# EAGLE design airball_sensor_board_v8 (EAGLE 9.6.2)

## Sheet 1 of 5
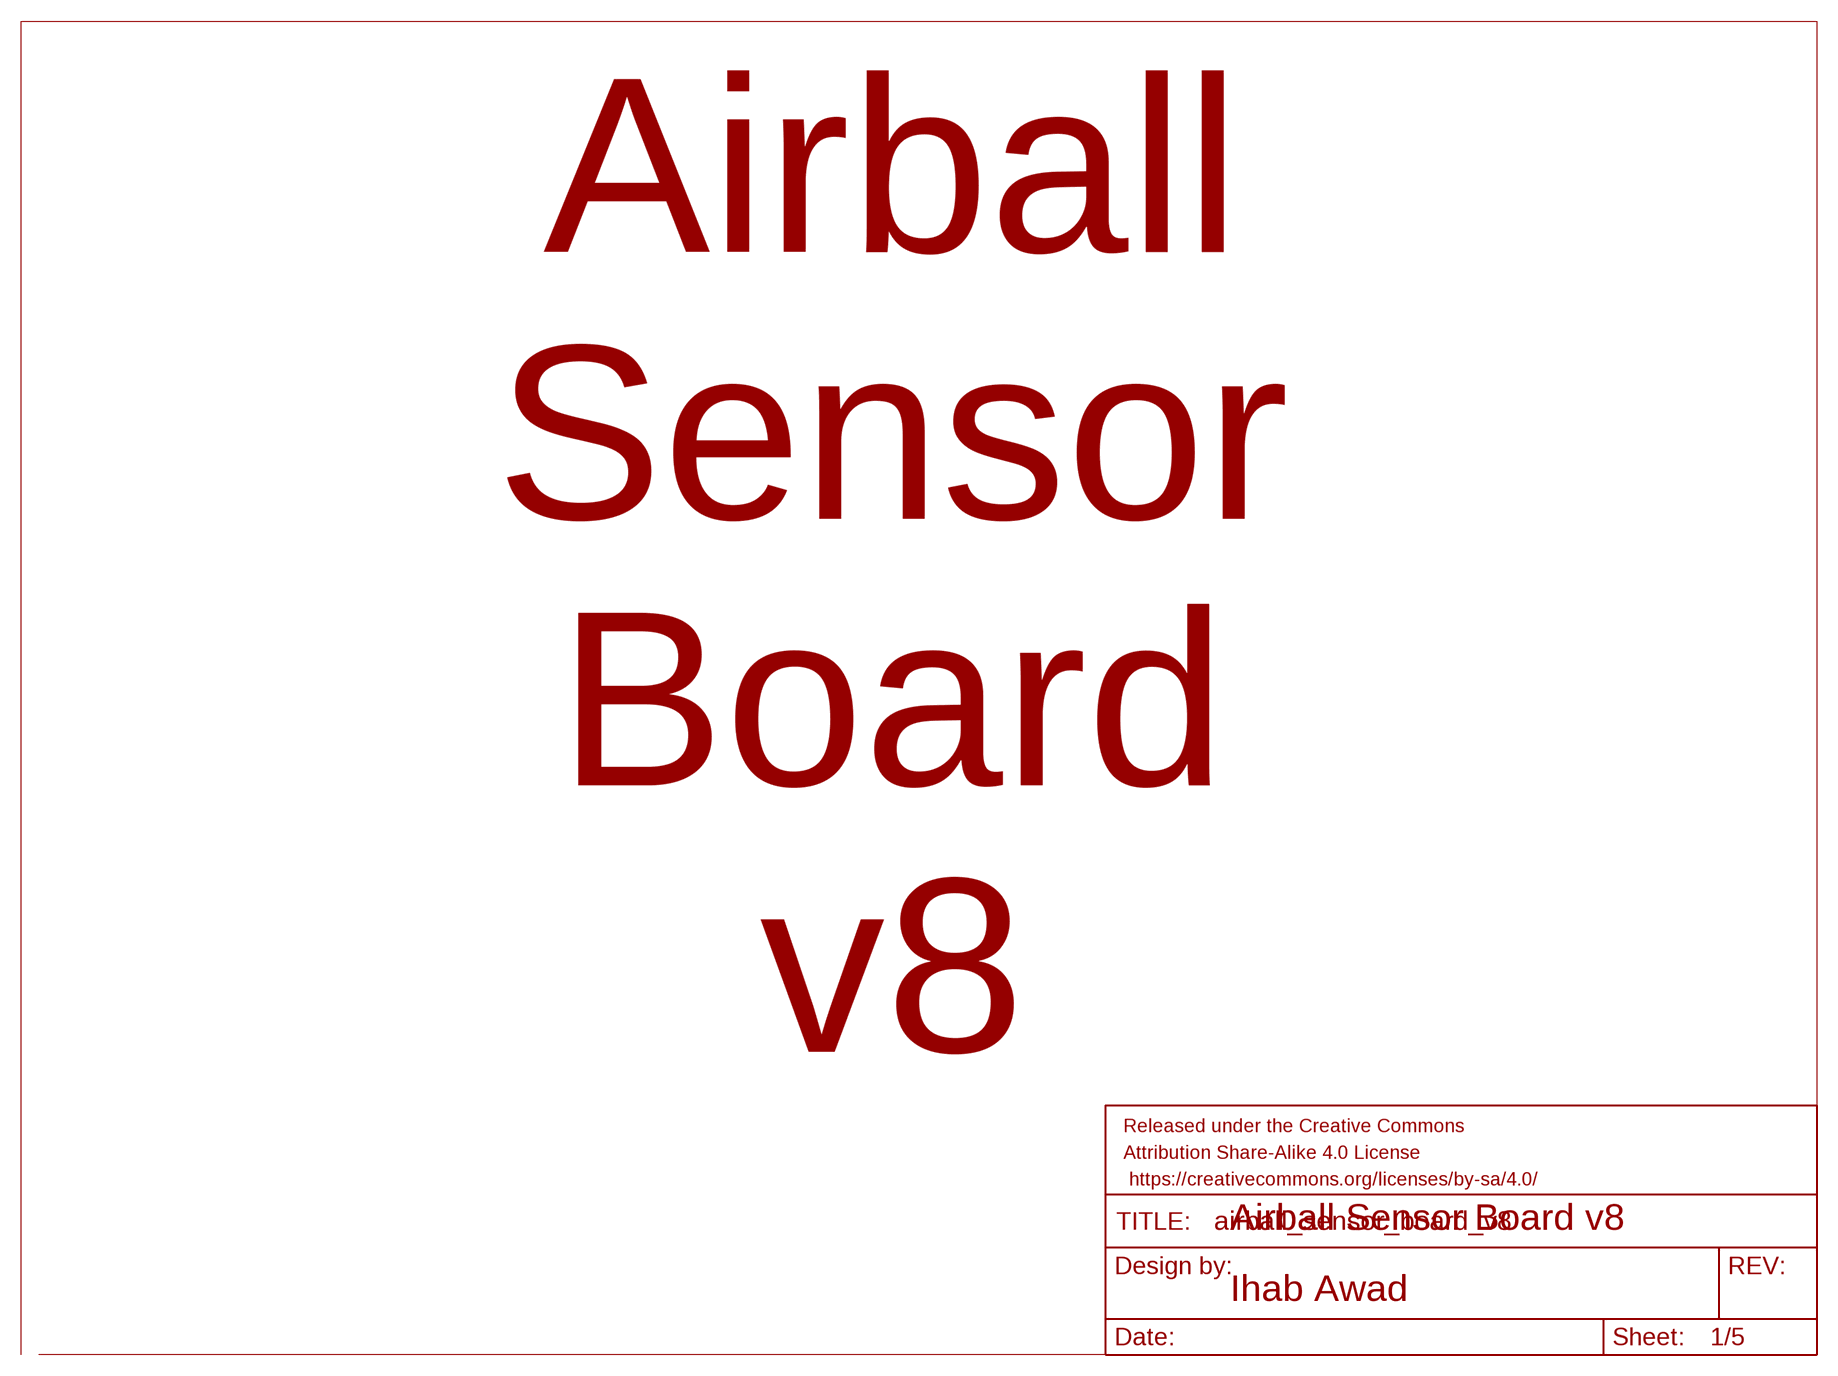
[diagram p0: schematic, sheet 1]

### Parts
FRAME1  FRAME-LETTER  [CREATIVE_COMMONS]

### Notes on the sheet
- Airball
  Sensor
  Board
  v8
- Airball Sensor Board v8
- Ihab Awad

## Sheet 2 of 5
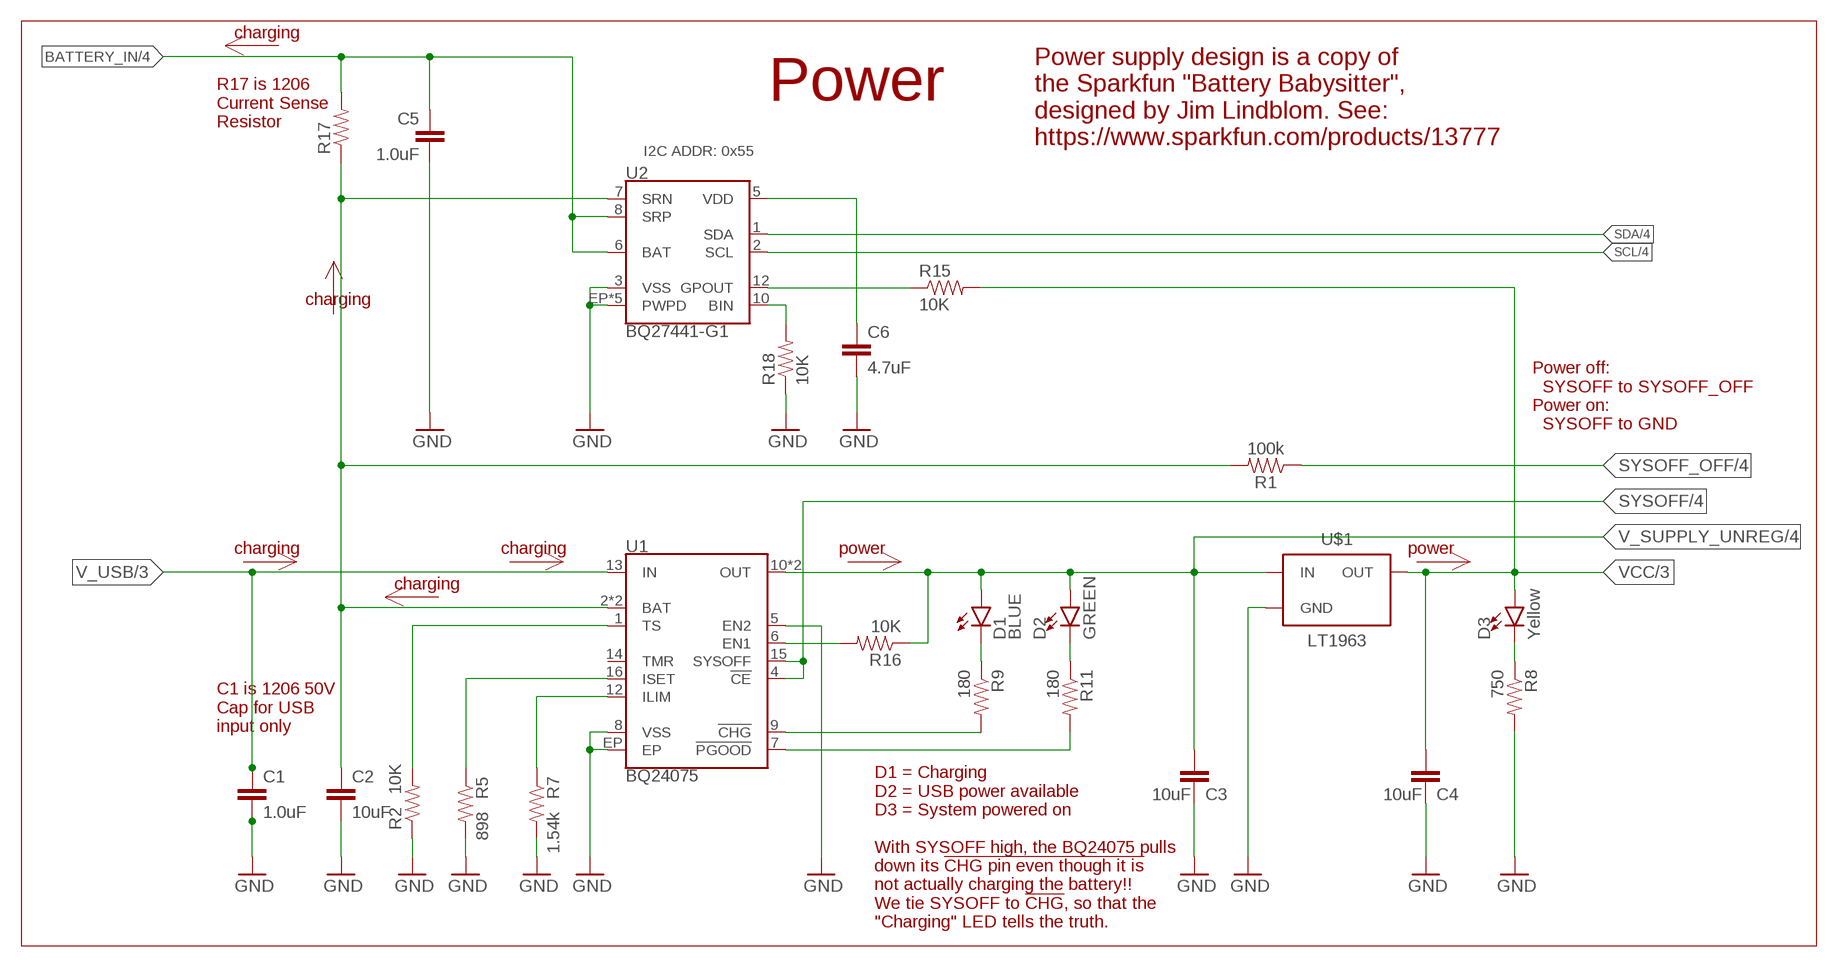
[diagram p1: schematic, sheet 2]

### Parts
C1  1.0uF  1.0UF50V10%(1206)  [1206-CAP]
C2  10uF  10UF10V10%(0805)  [0805-CAP]
C3  10uF  10UF10V10%(0805)  [0805-CAP]
C4  10uF  10UF10V10%(0805)  [0805-CAP]
C5  1.0uF  1.0UF-16V-10%(0603)  [0603-CAP]
C6  4.7uF  4.7UF-0603-35V-(20%)  [0603]
D1  BLUE  LED-BLUE0603  [LED-0603]
D2  GREEN  LED-GREEN0603  [LED-0603]
D3  Yellow  LED-YELLOW0603  [LED-0603]
R1  100k  100KOHM-0603-1/10W-1%  [0603]
R2  10K  10KOHM-1/10W-1%(0603)0603  [0603-RES]
R5  898  RESISTOR0603-RES  [0603-RES]
R7  1.54k  RESISTOR0603-RES  [0603-RES]
R8  750  10KOHM-1/10W-1%(0603)0603  [0603-RES]
R9  180  180OHM1/10W1%(0603)  [0603-RES]
R11  180  180OHM1/10W1%(0603)  [0603-RES]
R15  10K  10KOHM-1/10W-1%(0603)0603  [0603-RES]
R16  10K  10KOHM-1/10W-1%(0603)0603  [0603-RES]
R17  RESISTOR1206  [1206]
R18  10K  10KOHM-1/10W-1%(0603)0603  [0603-RES]
U1  BQ24075  [PVQFN-N16]
U2  BQ27441-G1  [PDSO-N12]
U$1  LT1963  [SOT223-3]

### Nets
!CHG!: R9.2 U1.9(!CHG!)
BATTERY_IN: C5.1 R17.2 U2.6(BAT) U2.8(SRP) ; also sheet 4
GND: C1.2 C2.2 C3.2 C4.2 C5.2 C6.2 R2.1 R5.2 R7.2 R8.2 R18.1 U1.5(EN2) U1.8(VSS) U1.EP U2.3(VSS) U2.EP1(PWPD) U2.EP2(PWPD) U2.EP3(PWPD) U2.EP4(PWPD) U2.EP(PWPD) U$1.2(GND) U$1.TAB(GND) ; also sheet 3,4,5
GPOUT: R15.1 U2.12(GPOUT)
ILIM: R7.1 U1.12(ILIM)
ISET: R5.1 U1.16(ISET)
N$6: R16.2 U1.6(EN1)
N$11: D1.C R9.1
N$14: C6.1 U2.5(VDD)
N$19: R11.2 U1.7(!PGOOD!)
N$20: D2.C R11.1
N$22: D3.C R8.1
N$23: R18.2 U2.10(BIN)
SCL: U2.2(SCL) ; also sheet 4,5
SDA: U2.1(SDA) ; also sheet 4,5
SYSOFF: U1.4(!CE!) U1.15(SYSOFF) ; also sheet 4
SYSOFF_OFF: R1.1 ; also sheet 4
TS: R2.2 U1.1(TS)
V_BATT: C2.1 R1.2 R17.1 U1.2(BAT) U1.3(BAT) U2.7(SRN)
V_SUPPLY_UNREG: C3.1 D1.A D2.A R16.1 U1.10(OUT) U1.11(OUT) U$1.1(IN) ; also sheet 4
V_USB: C1.1 U1.13(IN) ; also sheet 3,4
VCC: C4.1 D3.A R15.2 U$1.3(OUT) ; also sheet 3,4,5
Unconnected: U1.14(TMR)

### Notes on the sheet
- charging
- Power
- R17 is 1206
  Current Sense
  Resistor
- I2C ADDR: 0x55
- Power supply design is a copy of
  the Sparkfun "Battery Babysitter",
  designed by Jim Lindblom. See:
  https://www.sparkfun.com/products/13777
- charging
- Power off:
    SYSOFF to SYSOFF_OFF
  Power on:
    SYSOFF to GND
- charging | charging | power | power
- charging
- C1 is 1206 50V
  Cap for USB
  input only
- D1 = Charging
  D2 = USB power available
  D3 = System powered on
  
  With SYSOFF high, the BQ24075 pulls
  down its !CHG pin even though it is
  not actually charging the battery!!
  We tie SYSOFF to !CHG, so that the
  "Charging" LED tells the truth.

## Sheet 3 of 5
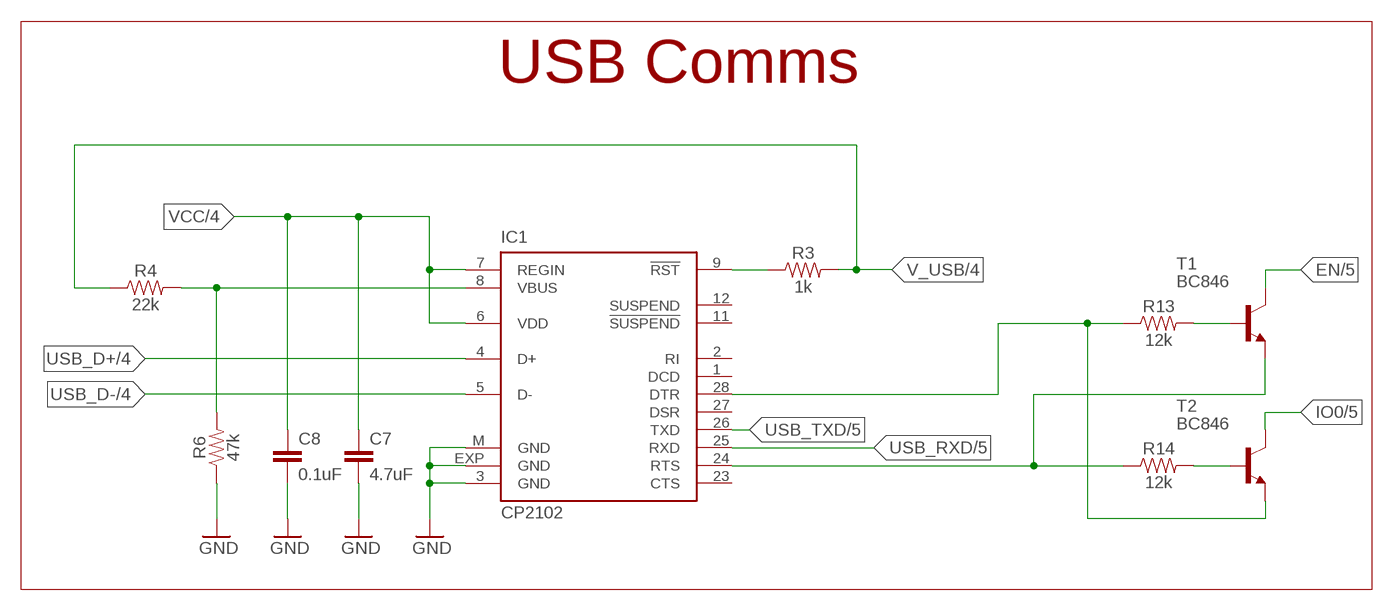
[diagram p2: schematic, sheet 3]

### Parts
C7  4.7uF  4.7UF-0603-35V-(20%)  [0603]
C8  0.1uF  0.1UF-0603-25V-(+80/-20%)  [0603]
IC1  CP2102  [MLP28]
R3  1k  1KOHM-0603-1/10W-1%  [0603]
R4  22k  22KOHM-0603-1/10W-1%  [0603]
R6  47k  47KOHM-0603-1/10W-1%  [0603]
R13  12k  12KOHM-0603-1/10W-1%  [0603]
R14  12k  12KOHM-0603-1/10W-1%  [0603]
T1  BC846  [SOT23]
T2  BC846  [SOT23]

### Nets
EN: T1.3(C) ; also sheet 5
GND: C7.2 C8.2 IC1.3(GND) IC1.EXP(GND) IC1.M(GND) R6.1 ; also sheet 2,4,5
IO0: T2.3(C) ; also sheet 5
N$4: IC1.9(!RST) R3.1
N$5: IC1.8(VBUS) R4.2 R6.2
N$7: R13.2 T1.1(B)
N$8: R14.2 T2.1(B)
USB_D+: IC1.4(D+) ; also sheet 4
USB_D-: IC1.5(D-) ; also sheet 4
USB_DTR: IC1.28(DTR) R13.1 T2.2(E)
USB_RTS: IC1.24(RTS) R14.1 T1.2(E)
USB_RXD: IC1.25(RXD) ; also sheet 5
USB_TXD: IC1.26(TXD) ; also sheet 5
V_USB: R3.2 R4.1 ; also sheet 2,4
VCC: C7.1 C8.1 IC1.6(VDD) IC1.7(REGIN) ; also sheet 2,4,5
Unconnected: IC1.1(DCD) IC1.2(RI) IC1.11(!SUSPEND) IC1.12(SUSPEND) IC1.23(CTS) IC1.27(DSR)

### Notes on the sheet
- USB Comms

## Sheet 4 of 5
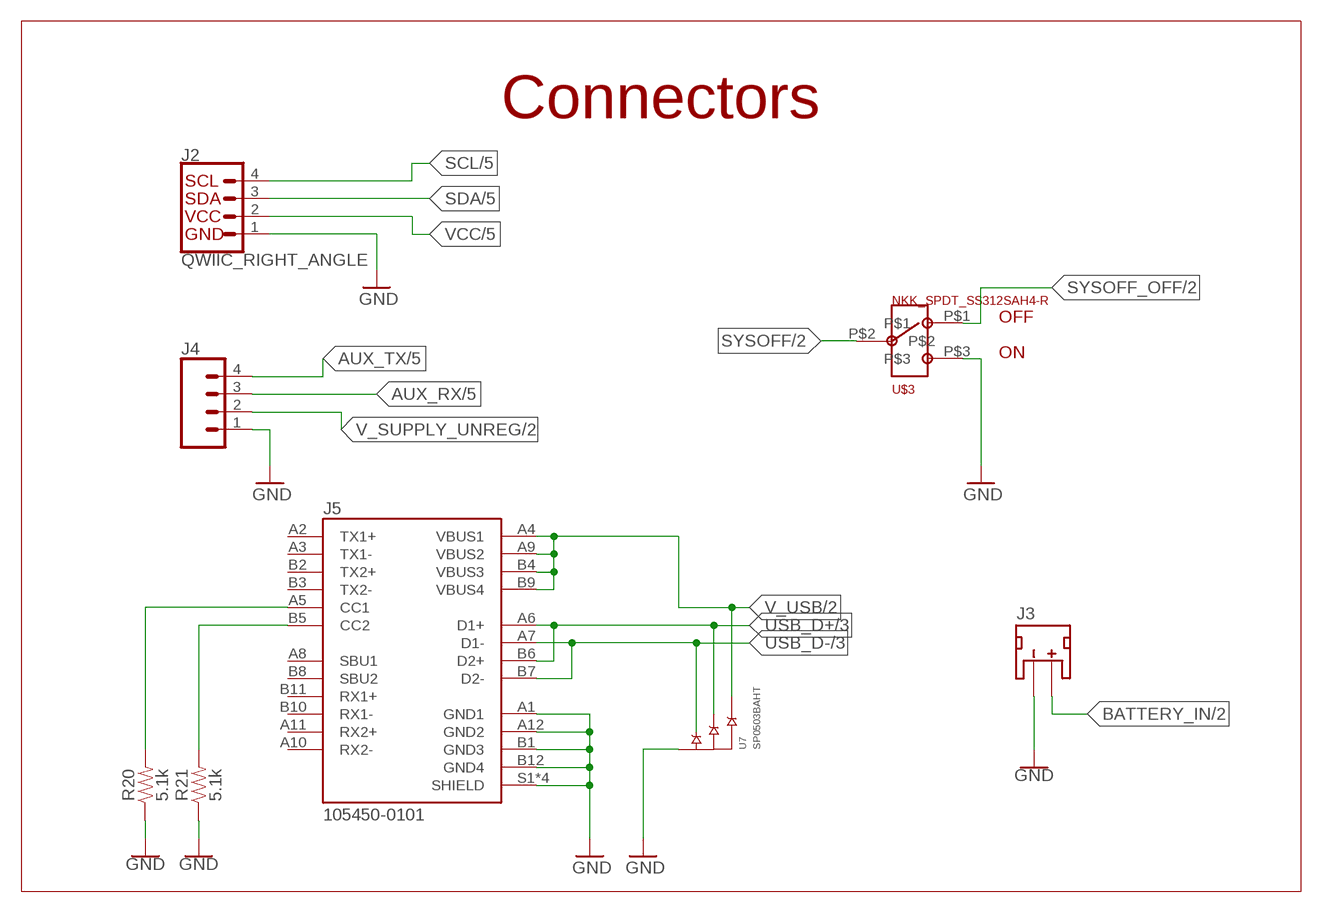
[diagram p3: schematic, sheet 4]

### Parts
J2  QWIIC_RIGHT_ANGLE  QWIIC_CONNECTORJS-1MM  [JST04_1MM_RA]
J3  JST_2MM_MALE  [JST-2-SMD]
J4  CONN_04PTH  [1X04]
J5  105450-0101  [MOLEX_105450-0101]
R20  5.1k  5.1KOHM5.1KOHM-0603-1/10W-1%  [0603]
R21  5.1k  5.1KOHM5.1KOHM-0603-1/10W-1%  [0603]
U7  SP0503BAHT  [SOT143]
U$3  NKK_SPDT_SS312SAH4-R  [NKK_SPDT_SS312SAH4-R]

### Nets
AUX_RX: J4.3 ; also sheet 5
AUX_TX: J4.4 ; also sheet 5
BATTERY_IN: J3.2(+) ; also sheet 2
GND: J2.1 J3.1(-) J4.1 J5.A1(GND1) J5.A12(GND2) J5.B1(GND3) J5.B12(GND4) J5.S1(SHIELD) J5.S2(SHIELD) J5.S3(SHIELD) J5.S4(SHIELD) R20.1 R21.1 U7.1(GND) U$3.P$3 ; also sheet 2,3,5
SCL: J2.4 ; also sheet 2,5
SDA: J2.3 ; also sheet 2,5
SYSOFF: U$3.P$2 ; also sheet 2
SYSOFF_OFF: U$3.P$1 ; also sheet 2
USB_CC1: J5.A5(CC1) R20.2
USB_CC2: J5.B5(CC2) R21.2
USB_D+: J5.A6(D1+) J5.B6(D2+) U7.3(B) ; also sheet 3
USB_D-: J5.A7(D1-) J5.B7(D2-) U7.2(A) ; also sheet 3
V_SUPPLY_UNREG: J4.2 ; also sheet 2
V_USB: J5.A4(VBUS1) J5.A9(VBUS2) J5.B4(VBUS3) J5.B9(VBUS4) U7.4(C) ; also sheet 2,3
VCC: J2.2 ; also sheet 2,3,5
Unconnected: J3.NC1(PAD1) J3.NC2(PAD2) J5.A2(TX1+) J5.A3(TX1-) J5.A8(SBU1) J5.A10(RX2-) J5.A11(RX2+) J5.B2(TX2+) J5.B3(TX2-) J5.B8(SBU2) J5.B10(RX1-) J5.B11(RX1+)

### Notes on the sheet
- Connectors
- OFF
- ON

## Sheet 5 of 5
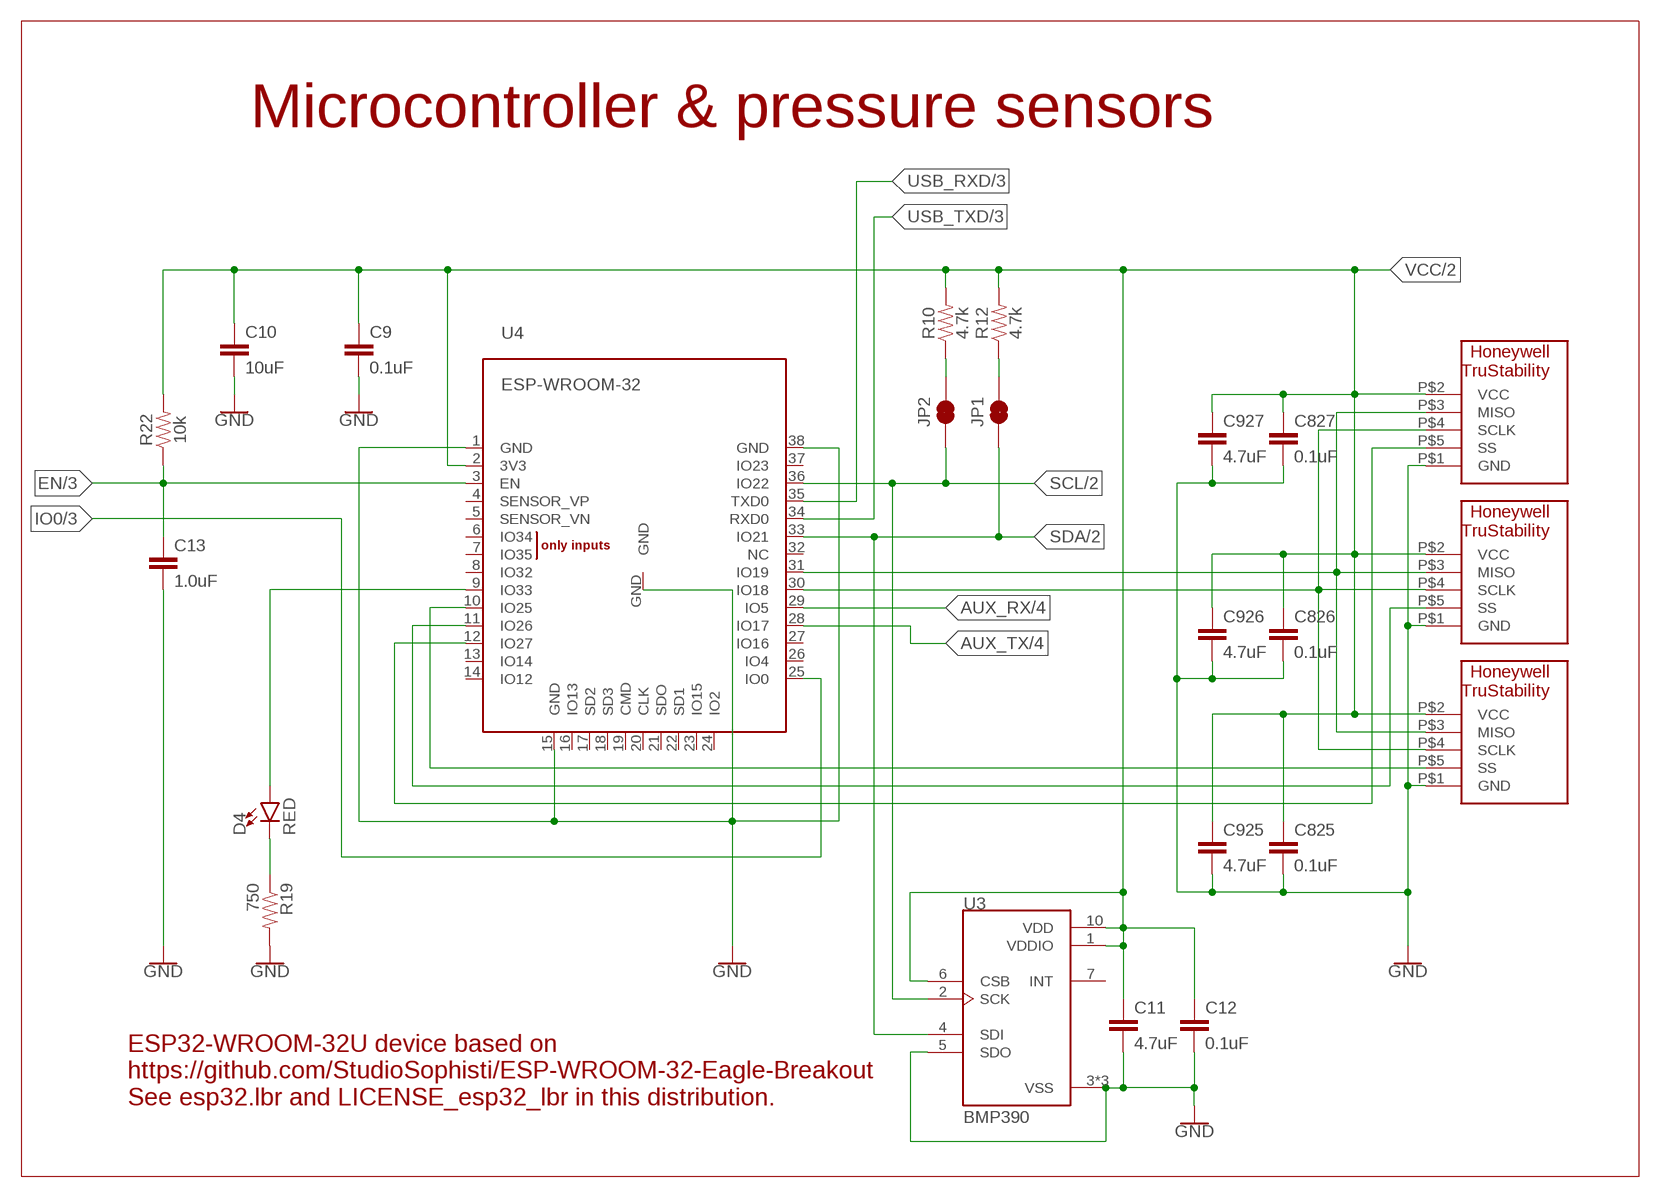
[diagram p4: schematic, sheet 5]

### Parts
C9  0.1uF  0.1UF-0603-25V-(+80/-20%)  [0603]
C10  10uF  10UF-0603-6.3V-20%  [0603]
C11  4.7uF  4.7UF-0603-6.3V-(10%)  [0603]
C12  0.1uF  0.1UF-0603-25V-(+80/-20%)  [0603]
C13  1.0uF  1.0UF-0603-16V-10%  [0603]
C825  0.1uF  0.1UF-0603-25V-(+80/-20%)  [0603]
C826  0.1uF  0.1UF-0603-25V-(+80/-20%)  [0603]
C827  0.1uF  0.1UF-0603-25V-(+80/-20%)  [0603]
C925  4.7uF  4.7UF-0603-6.3V-(10%)  [0603]
C926  4.7uF  4.7UF-0603-6.3V-(10%)  [0603]
C927  4.7uF  4.7UF-0603-6.3V-(10%)  [0603]
D4  RED  LED-RED0603  [LED-0603]
JP1  JUMPER-SMT_2_NC_TRACE_SILK  [SMT-JUMPER_2_NC_TRACE_SILK]
JP2  JUMPER-SMT_2_NC_TRACE_SILK  [SMT-JUMPER_2_NC_TRACE_SILK]
R10  4.7k  4.7KOHM-0603-1/10W-1%  [0603]
R12  4.7k  4.7KOHM-0603-1/10W-1%  [0603]
R19  750  10KOHM-1/10W-1%(0603)0603  [0603-RES]
R22  10k  10KOHM-0603-1/10W-1%  [0603]
U3  BMP390  [PQFN50P200X200X80-10N]
U4  ESP-WROOM-32  [ESP-WROOM-32]
U$925  HONEYWELL_HSC_SMT  [HONEYWELL_HSC_SMT]
U$926  HONEYWELL_HSC_SMT  [HONEYWELL_HSC_SMT]
U$927  HONEYWELL_HSC_SMT  [HONEYWELL_HSC_SMT]

### Nets
AUX_RX: U4.29(IO5) ; also sheet 4
AUX_TX: U4.28(IO17) ; also sheet 4
EN: C13.1 R22.1 U4.3(EN) ; also sheet 3
GND: C9.2 C10.2 C11.2 C12.2 C13.2 C825.2 C826.2 C827.2 C925.2 C926.2 C927.2 R19.2 U3.3(VSS) U3.5(SDO) U3.8(VSS) U3.9(VSS) U4.1(GND) U4.15(GND) U4.38(GND) U4.GND U$925.P$1(GND) U$926.P$1(GND) U$927.P$1(GND) ; also sheet 2,3,4
IO0: U4.25(IO0) ; also sheet 3
MISO: U4.31(IO19) U$925.P$3(MISO) U$926.P$3(MISO) U$927.P$3(MISO)
N$1: D4.A U4.9(IO33)
N$2: D4.C R19.1
N$3: JP2.2 R10.1
N$9: JP1.2 R12.1
SCL: JP2.1 U3.2(SCK) U4.36(IO22) ; also sheet 2,4
SCLK: U4.30(IO18) U$925.P$4(SCLK) U$926.P$4(SCLK) U$927.P$4(SCLK)
SDA: JP1.1 U3.4(SDI) U4.33(IO21) ; also sheet 2,4
SS_25: U4.10(IO25) U$925.P$5(SS)
SS_26: U4.11(IO26) U$926.P$5(SS)
SS_27: U4.12(IO27) U$927.P$5(SS)
USB_RXD: U4.35(TXD0) ; also sheet 3
USB_TXD: U4.34(RXD0) ; also sheet 3
VCC: C9.1 C10.1 C11.1 C12.1 C825.1 C826.1 C827.1 C925.1 C926.1 C927.1 R10.2 R12.2 R22.2 U3.1(VDDIO) U3.6(CSB) U3.10(VDD) U4.2(3V3) U$925.P$2(VCC) U$926.P$2(VCC) U$927.P$2(VCC) ; also sheet 2,3,4
Unconnected: U3.7(INT) U4.4(SENSOR_VP) U4.5(SENSOR_VN) U4.6(IO34) U4.7(IO35) U4.8(IO32) U4.13(IO14) U4.14(IO12) U4.16(IO13) U4.17(SD2) U4.18(SD3) U4.19(CMD) U4.20(CLK) U4.21(SDO) U4.22(SD1) U4.23(IO15) U4.24(IO2) U4.26(IO4) U4.27(IO16) U4.32(NC) U4.37(IO23)

### Notes on the sheet
- Microcontroller & pressure sensors
- ESP32-WROOM-32U device based on
  https://github.com/StudioSophisti/ESP-WROOM-32-Eagle-Breakout
  See esp32.lbr and LICENSE_esp32_lbr in this distribution.

## Library data of the parts
C1 = SparkFun-Capacitors:1.0UF50V10%(1206): CAP-09822; PROD_ID: CAP-09822
C2-C4 = SparkFun-Capacitors:10UF10V10%(0805): CAP-11330; PROD_ID: CAP-11330
C5 = SparkFun-Capacitors:1.0UF-16V-10%(0603): CAP-00868; PROD_ID: CAP-00868
C6 C7 = SparkFun-Capacitors:4.7UF: 4.7µF ceramic capacitors A capacitor is a passive two-terminal electrical component used to store electrical energy temporarily in an electric field.; PROD_ID: CAP-14106
C8 C9 C12 C825-C827 = SparkFun-Capacitors:0.1UF: 0.1µF ceramic capacitors A capacitor is a passive two-terminal electrical component used to store electrical energy temporarily in an electric field.; PROD_ID: CAP-00810
C10 = SparkFun-Capacitors:10UF: 10.0µF ceramic capacitors A capacitor is a passive two-terminal electrical component used to store electrical energy temporarily in an electric field.; PROD_ID: CAP-11015
C11 C925-C927 = SparkFun-Capacitors:4.7UF: 4.7µF ceramic capacitors A capacitor is a passive two-terminal electrical component used to store electrical energy temporarily in an electric field.; PROD_ID: CAP-08280
C13 = SparkFun-Capacitors:1.0UF: 1µF ceramic capacitors A capacitor is a passive two-terminal electrical component used to store electrical energy temporarily in an electric field.; PROD_ID: CAP-00868
D1 = SparkFun-LED:LED-BLUE: Blue SMD LED Used in manufacturing of various products at SparkFun Packages: 0603 - SMD 0603 package [Product Link] <http://www.digikey.com/product-detail/en/SMLE12BC7TT86/511-1589-2-ND/1641808> 1206 - SMD1206 package [Product Link] <http://www.digikey.com/product-detail/en/lite-on-inc/LTST-C150TBKT/160-1643-1-ND/573584> SparkFun Products: ESP8266 Thing-Dev Board <https://www.sparkfun.com/products/13711> RedBoard <https://www.sparkfun.com/products/12757>; PROD_ID: DIO-08575
D2 = SparkFun-LED:LED-GREEN: Green SMD LED Used in manufacturing of various products at SparkFun Packages: 0603 - SMD 0603 package [Product Link] <http://www.futureelectronics.com/en/technologies/semiconductors/optoelectronics/leds/Pages/9894312-LTST-C190GKT.aspx?CrossPart=HSMG-C190&IM=0> LilyPad 1206 - SMD1206 LilyPad package [Product Link] <http://www.futureelectronics.com/en/Technologies/Product.aspx?ProductID=IN150NGHARVATEKCORPORATION2049943&IM=0> 1206 - SMD1206 package [Product Link] <http://www.futureelectronics.com/en/technologies/semiconductors/optoelectronics/leds/Pages/8315665-LTST-C150KGKT.aspx?IM=0> 1206 Bottom Mount -SMD 1206 Bottom Mount [Product Link] <http://www.digikey.com/product-detail/en/lite-on-inc/LTST-C230KGKT/160-1456-1-ND/386854> SparkFun Products: Pro Mini 328 -5V <https://www.sparkfun.com/products/821> RedBoard <https://www.sparkfun.com/products/12757> MP3 Trigger <https://www.sparkfun.com/products/13720> Makey Makey <https://www.sparkfun.com/products/11076>; PROD_ID: DIO-00821
D3 = SparkFun-LED:LED-YELLOW: Yellow SMD LED Used in manufacturing several products at SparkFun. Packages: 0603 - SMD 0603 package[Product Link] <http://www.kingbrightusa.com/product.asp?catalog_name=LED&product_id=APT1608SYCK> 0603 -SMART - SMART SMD 0603 package (more efficient/more expensive) [Product Link] <http://www.osram-os.com/osram_os/en/products/product-catalog/led-light-emitting-diodes/smartled-0603/ly-l29k/index.jsp> LilyPad - SMD1206 package[Product Datasheet] <https://www.sparkfun.com/datasheets/DevTools/LilyPad/Q150YUS4.pdf> SparkFun Products: Blynk Board <https://www.sparkfun.com/products/13794> IOIO-OTG <https://www.sparkfun.com/products/13613> XBee Explorer Serial <https://www.sparkfun.com/products/13225>; PROD_ID: DIO-09003
D4 = SparkFun-LED:LED-RED: Red SMD LED Used in manufacturing of most products at SparkFun Packages: 0603 - SMD 0603 package [Product Link] <http://docs.avagotech.com/docs/AV02-0551EN> 0603 SMART - SMD 0603 SMART package ( more efficient and expensive)[Product Link] <http://www.osram-os.com/Graphics/XPic2/00077099_0.pdf> 1206 - SMD1206 package [Product Link] <https://www.sparkfun.com/datasheets/DevTools/LilyPad/Q150OVS4.pdff> SparkFun Products: Pro Mini 328 -5V <https://www.sparkfun.com/products/821> RedBoard <https://www.sparkfun.com/products/12757> IOIO-OTG <https://www.sparkfun.com/products/13613>; PROD_ID: DIO-00819
FRAME1 = SparkFun-Aesthetics:FRAME-LETTER: Schematic Frame Standard 8.5x11 US Letter frame
IC1 = silabs:CP210*: Single-Chip USB to UART Bridge Source: www.silabs.com .. CP2101.pdf / cp2102.pdf; MF: FARNELL; MPN: CP2102-GM; OC_FARNELL: 9282130; OC_NEWARK: 30K5635
J2 = SparkFun-Connectors:QWIIC_CONNECTOR: SparkFun I2C Standard Qwiic Connector An SMD 1mm pitch JST connector makes it easy and quick (get it? Qwiic?) to connect I2C devices to each other. The Qwiic system <http://www.sparkfun.com/qwiic> enables fast and solderless connection between popular platforms and various sensors and actuators. We carry 200mm <https://www.sparkfun.com/products/14204>, 100mm <https://www.sparkfun.com/products/14205>, 50mm <https://www.sparkfun.com/products/14206>, and breadboard friendly <https://www.sparkfun.com/products/14207> Qwiic cables. We also offer 10 pcs strips <https://www.sparkfun.com/products/14323> the SMD connectors.; PROD_ID: CONN-13694
J3 = SparkFun-Connectors:JST_2MM_MALE: JST 2MM MALE RA CONNECTOR Two pin, compact surface mount connector. Commonly used as a battery input connection point. We really like the solid locking feeling and high current rating on these small connectors. We use these all the time as battery connectors. Mates to single-cell LiPo batteries. Here is the connector we sell at SparkFun: JST Right Angle Connector - White <https://www.sparkfun.com/products/8612> (PRT-08612) Datasheet <http://www.sparkfun.com/datasheets/Prototyping/Connectors/JST-Horizontal.pdf> It was used on these SparkFun products: SparkFun MOSFET Power Controller <https://www.sparkfun.com/products/11214> (PRT-11214) SparkFun Battery Babysitter - LiPo Battery Manager <https://www.sparkfun.com/products/13777> (PRT-13777) And many, many others that required a lipo battery connection.; PROD_ID: CONN-11443; SF_ID: PRT-08612
J4 = SparkFun-Connectors:CONN_04: Multi connection point. Often used as Generic Header-pin footprint for 0.1 inch spaced/style header connections On any of the 0.1 inch spaced packages, you can populate with these: Break Away Headers - Straight <https://www.sparkfun.com/products/116> (PRT-00116) Break Away Male Headers - Right Angle <https://www.sparkfun.com/products/553> (PRT-00553) Female Headers <https://www.sparkfun.com/products/115> (PRT-00115) Break Away Headers - Machine Pin <https://www.sparkfun.com/products/117> (PRT-00117) Break Away Female Headers - Swiss Machine Pin <https://www.sparkfun.com/products/743> (PRT-00743) For SCREWTERMINALS and SPRING TERMINALS visit here: Screw Terimnals on SparkFun.com <https://www.sparkfun.com/search/results?term=Screw+Terminals> (5mm/3.5mm/2.54mm spacing) This device is also useful as a general connection point to wire up your design to another part of your project. Our various solder wires solder well into these plated through hole pads. Hook-Up Wire - Assortment (Stranded, 22 AWG) <https://www.sparkfun.com/products/11375> (PRT-11375) Hook-Up Wire - Assortment (Solid Core, 22 AWG) <https://www.sparkfun.com/products/11367> (PRT-11367) View the entire wire category on our website here <https://www.sparkfun.com/categories/141> Special notes: Molex polarized connector foot print use with SKU : PRT-08231 with associated crimp pins and housings. 1MM SMD Version SKU: PRT-10208; PROD_ID: CONN-09696
J5 = 105450-0101:105450-0101: USB Shielded I/O Receptacle; Type C; Right Angle; Surface Mount; Gold over Nickel; DESCRIPTION: USB-C (USB TYPE-C) USB 3.2 Gen 2 (USB 3.1 Gen 2, Superspeed + (USB 3.1)) Receptacle Connector 24 Position Surface Mount, Right Angle; Through Hole; DIGI-KEY_PART_NUMBER: WM12856CT-ND; MF: Molex; MP: 1054500101; PACKAGE: None; PURCHASE-URL: https://pricing.snapeda.com/search/part/1054500101/?ref=eda
JP1 JP2 = SparkFun-Jumpers:JUMPER-SMT_2_NC_TRACE: Normally closed trace jumper This jumper has a trace between two pads so it's normally closed (NC). Use a razor knife to open the connection. For best results follow the IPC guidelines for cutting traces: Cutout at least 0.063 mm (0.005 in). Remove all loose material to clean up the cut area. Seal the cut with an approved epoxy. Reapply solder to reclose the connection.
R1 = SparkFun-Resistors:100KOHM: 100kΩ resistor A resistor is a passive two-terminal electrical component that implements electrical resistance as a circuit element. Resistors act to reduce current flow, and, at the same time, act to lower voltage levels within circuits. - Wikipedia; PROD_ID: RES-07828
R2 R15 R16 R18 = SparkFun-Resistors:10KOHM-1/10W-1%(0603): RES-00824; PROD_ID: RES-00824
R3 = SparkFun-Resistors:1KOHM: 1kΩ resistor A resistor is a passive two-terminal electrical component that implements electrical resistance as a circuit element. Resistors act to reduce current flow, and, at the same time, act to lower voltage levels within circuits. - Wikipedia; PROD_ID: RES-07856
R4 = SparkFun-Resistors:22KOHM: 22kΩ resistor A resistor is a passive two-terminal electrical component that implements electrical resistance as a circuit element. Resistors act to reduce current flow, and, at the same time, act to lower voltage levels within circuits. - Wikipedia; PROD_ID: RES-07853
R5 = SparkFun-Passives:RESISTOR: Resistor Basic schematic elements and footprints for 0603, 1206, and PTH resistors.; PROD_ID: RES-13217
R6 = SparkFun-Resistors:47KOHM: 47kΩ resistor A resistor is a passive two-terminal electrical component that implements electrical resistance as a circuit element. Resistors act to reduce current flow, and, at the same time, act to lower voltage levels within circuits. - Wikipedia; PROD_ID: RES-07871
R7 = SparkFun-Passives:RESISTOR: Resistor Basic schematic elements and footprints for 0603, 1206, and PTH resistors.; PROD_ID: RES-10447
R8 R19 = SparkFun-Resistors:10KOHM-1/10W-1%(0603): RES-00824; PROD_ID: RES-00824; VALUE: 10K
R9 R11 = SparkFun-Resistors:180OHM1/10W1%(0603): RES-08788; PROD_ID: RES-08788
R10 R12 = SparkFun-Resistors:4.7KOHM: 4.7kΩ resistor A resistor is a passive two-terminal electrical component that implements electrical resistance as a circuit element. Resistors act to reduce current flow, and, at the same time, act to lower voltage levels within circuits. - Wikipedia; PROD_ID: RES-07857
R13 R14 = SparkFun-Resistors:12KOHM: 12kΩ resistor A resistor is a passive two-terminal electrical component that implements electrical resistance as a circuit element. Resistors act to reduce current flow, and, at the same time, act to lower voltage levels within circuits. - Wikipedia; PROD_ID: RES-10327
R17 = SparkFun-Resistors:RESISTOR: Generic Resistor Package; PROD_ID: RES-13218
R20 R21 = SparkFun-Resistors:5.1KOHM; PROD_ID: RES-12083
R22 = SparkFun-Resistors:10KOHM: 10kΩ resistor A resistor is a passive two-terminal electrical component that implements electrical resistance as a circuit element. Resistors act to reduce current flow, and, at the same time, act to lower voltage levels within circuits. - Wikipedia; PROD_ID: RES-00824
T1 T2 = transistor:BC846: NPN TRANSISTOR
U1 = battery-management-temp:BQ24075; PROD_ID: IC-13219
U2 = battery-management-temp:BQ27441-G1; PROD_ID: IC-13220
U3 = BMP388:BMP390: P-Sensor SPI I2C 1, 25 Bar SMD; AVAILABILITY: Unavailable; DESCRIPTION: Pressure Sensor 4.35PSI ~ 18.13PSI _30kPa ~ 125kPa_ Absolute 10-WFLGA; MF: Bosch Sensortec; MP: BMP390; PACKAGE: WFLGA-10 Bosch Tools; PRICE: None
U4 = esp32:ESP-WROOM-32
U7 = SP0503BAHT:SP0503BAHT; DESCRIPTION: 8.5V Clamp Ipp Tvs Diode Surface Mount SOT-143-4; DIGI-KEY_PART_NUMBER: F2715TR-ND; DIGI-KEY_PURCHASE_URL: https://www.digikey.com/product-detail/en/littelfuse-inc/SP0503BAHTG/F2715TR-ND/1154308?utm_source=snapeda&utm_medium=aggregator&utm_campaign=symbol; MF: Littelfuse Inc.; MP: SP0503BAHT; PACKAGE: SOT-143 Littelfuse
U$1 = airball:LT1963
U$3 = airball:NKK_SPDT_SS312SAH4-R
U$925-U$927 = airball:HONEYWELL_HSC_SMT

## Net classes
0 default: clearance 0.205 mm

## Board
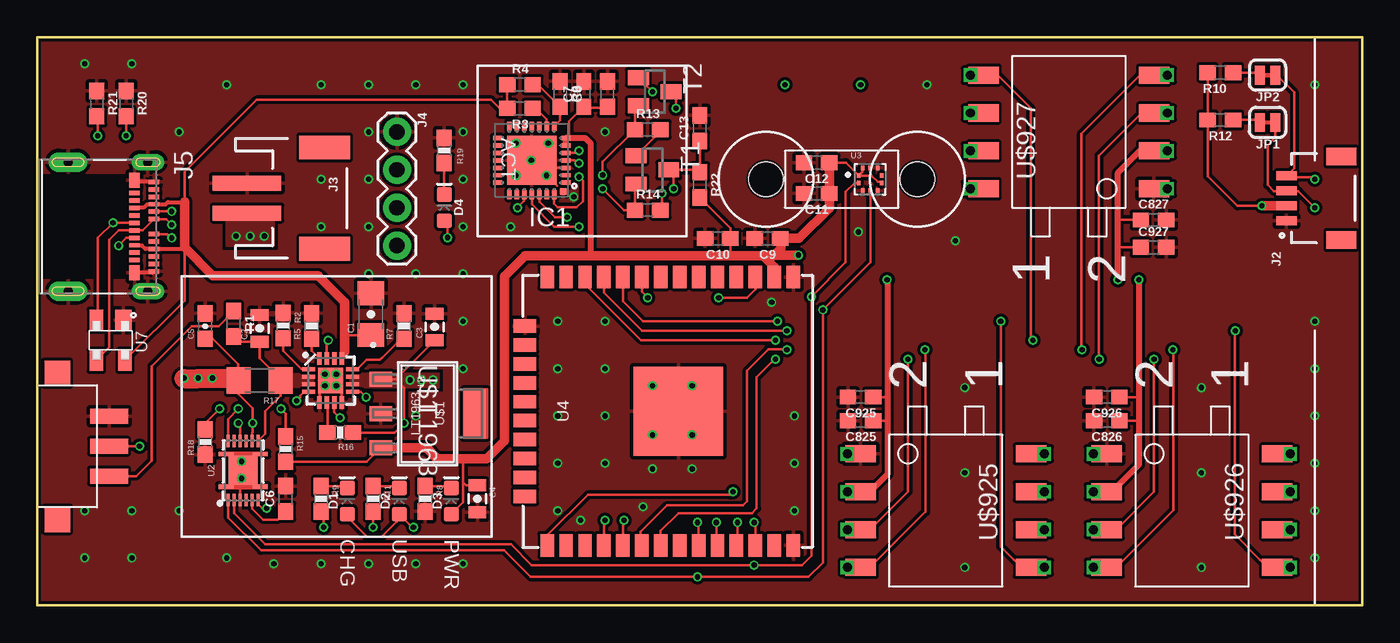
[diagram p5: board, top side]
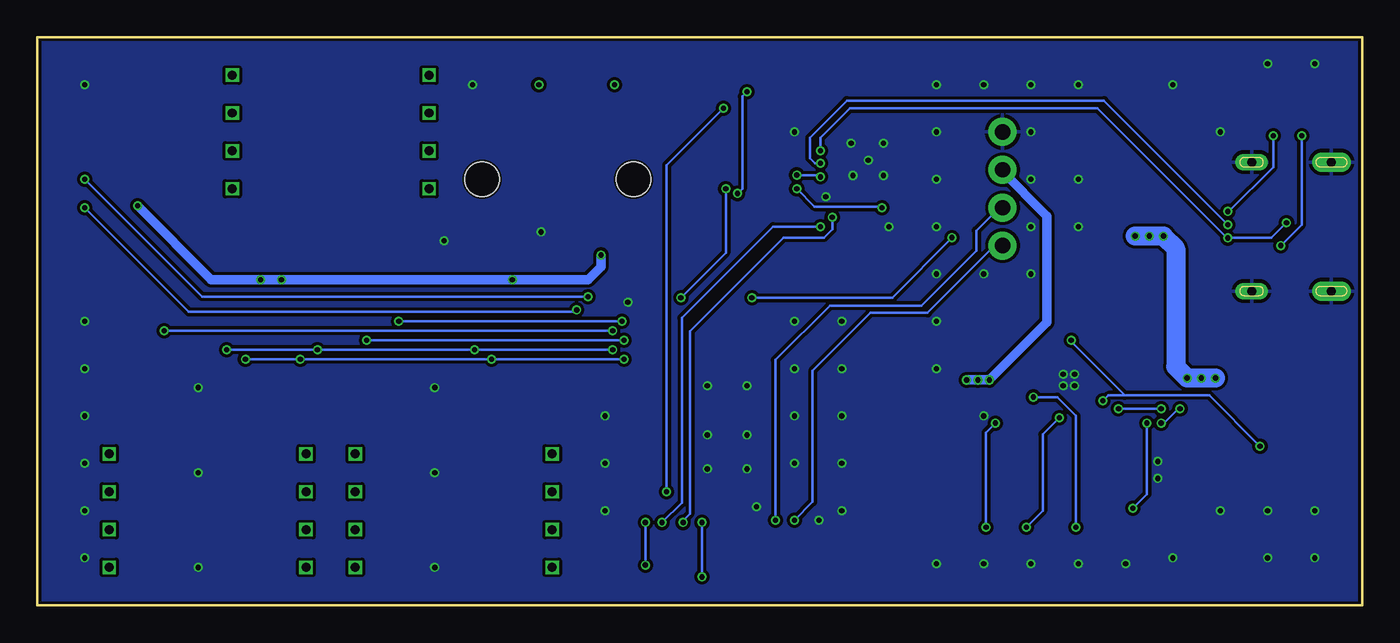
[diagram p6: board, bottom side, seen from below]

Size 88.9 x 38.1 mm. Coordinates in mm from the lower left corner, seen from the top.
Outline: 0,0 0,38.1 88.9,38.1 88.9,0 0,0
Copper layers (1*16): Top 0.035mm / dielectric 1.5mm / Bottom 0.035mm
Design rules "SparkFun-2-layer-FAB-LIMIT *": minimum track width 7mil, minimum drill 6mil, track to track 7mil, track to pad 7mil, pad to pad 7mil, via to via 7mil, smd to smd 7mil, copper to edge 7mil, drill to drill 7mil, minimum pad ring 5mil, minimum via ring 5mil, stop-mask expansion 1mil, vias tented up to drill 20mil, thermal gap 10mil
Holes 2.29 mm at 48.9,28.57 59.05,28.57

### Footprints (pad centres in the part's own frame; a part is rotated, then mirrored left to right if it is on the bottom)
1206-CAP = smd 1.6 x 1.8: 1 -1.4,0; 2 1.4,0
0805-CAP = smd 0.8 x 1.2: 1 -0.9,0; 2 0.9,0
0603-CAP = smd 1.1 x 1: 1 -0.85,0; 2 0.85,0
0603 = smd 1.1 x 1: 1 -0.85,0; 2 0.85,0
LED-0603 = smd 1 x 1: A -0.877,0; C 0.877,0
MLP28 = smd 0.6 x 0.3: 1 -2.3,1.5; 2 -2.3,1; 3 -2.3,0.5; 4 -2.3,0; 5 -2.3,-0.5; 6 -2.3,-1; 7 -2.3,-1.5; 15 2.3,-1.5; 16 2.3,-1; 17 2.3,-0.5; 18 2.3,0; 19 2.3,0.5; 20 2.3,1; 21 2.3,1.5 | smd 0.3 x 0.6: 8 -1.5,-2.3; 9 -1,-2.3; 10 -0.5,-2.3; 11 0,-2.3; 12 0.5,-2.3; 13 1,-2.3; 14 1.5,-2.3; 22 1.5,2.3; 23 1,2.3; 24 0.5,2.3; 25 0,2.3; 26 -0.5,2.3; 27 -1,2.3; 28 -1.5,2.3 | smd 3.3 x 3.3: EXP 0,0 | smd 0.435 x 0.435: M -2.103,2.103
JST04_1MM_RA = smd 0.6 x 1.35: 1 -1.5,0; 2 -0.5,0; 3 0.5,0; 4 1.5,0 | smd 1.2 x 2: NC1 2.8,-3.675; NC2 -2.8,-3.675
JST-2-SMD = smd 1 x 4.6: 1 -1,-3.7; 2 1,-3.7 | smd 1.6 x 3.4: NC1 -3.4,1.5; NC2 3.4,1.5
1X04 = drill 1.016 pad 1.88: 1 0,0; 2 2.54,0; 3 5.08,0; 4 7.62,0
MOLEX_105450-0101 = smd 0.3 x 0.7: A1 -3,3.77; A2 -2.5,3.77; A3 -2,3.77; A4 -1.5,3.77; A5 -1,3.77; A6 -0.5,3.77; A7 0.5,3.77; A8 1,3.77; A9 1.5,3.77; A10 2,3.77; A11 2.5,3.77; A12 3,3.77; B2 2.25,2.47; B3 1.75,2.47; B4 1.25,2.47; B5 0.75,2.47; B6 0.25,2.47; B7 -0.25,2.47; B8 -0.75,2.47; B9 -1.25,2.47; B10 -1.75,2.47; B11 -2.25,2.47 | smd 1 x 0.7: B1 3.1,2.47; B12 -3.1,2.47 | drill 0.6 pad 1.1 long: S1 -4.32,3.36; S2 4.32,3.36 | drill 0.6 pad 1.3 long: S3 -4.32,-2; S4 4.32,-2
SMT-JUMPER_2_NC_TRACE_SILK = smd 0.66 x 1.27: 1 -0.521,0; 2 0.521,0
0603-RES = smd 1.1 x 1: 1 -0.85,0; 2 0.85,0
1206 = smd 1.6 x 1.8: 1 -1.4,0; 2 1.4,0
SOT23 = smd 1 x 1.4: 1 -0.95,-1.1; 2 0.95,-1.1; 3 0,1.1
PVQFN-N16 = smd 0.28 x 0.85: 1 -0.75,-1.475; 2 -0.25,-1.475; 3 0.25,-1.475; 4 0.75,-1.475; 9 0.75,1.475; 10 0.25,1.475; 11 -0.25,1.475; 12 -0.75,1.475 | smd 0.85 x 0.28: 5 1.475,-0.75; 6 1.475,-0.25; 7 1.475,0.25; 8 1.475,0.75; 13 -1.475,0.75; 14 -1.475,0.25; 15 -1.475,-0.25; 16 -1.475,-0.75 | smd 1.7 x 1.7: EP 0,0
PDSO-N12 = smd 0.2 x 0.85: 1 -1,-1.975; 2 -0.6,-1.975; 3 -0.2,-1.975; 4 0.2,-1.975; 5 0.6,-1.975; 6 1,-1.975; 7 1,1.975; 8 0.6,1.975; 9 0.2,1.975; 10 -0.2,1.975; 11 -0.6,1.975; 12 -1,1.975 | smd 1.95 x 1.95: EP 0,0 | smd 1 x 0.25: EP1 -1.15,1.1; EP2 -1.15,-1.1; EP3 1.15,-1.1; EP4 1.15,1.1
PQFN50P200X200X80-10N = smd 0.254 x 0.254: 1 -0.765,0.25; 2 -0.765,-0.25; 3 -0.5,-0.765; 4 0,-0.765; 5 0.5,-0.765; 6 0.765,-0.25; 7 0.765,0.25; 8 0.5,0.765; 9 0,0.765; 10 -0.5,0.765
ESP-WROOM-32 = smd 0.9 x 1.5: 1 7.7,9; 2 6.43,9; 3 5.16,9; 4 3.89,9; 5 2.62,9; 6 1.35,9; 7 0.08,9; 8 -1.19,9; 9 -2.46,9; 10 -3.73,9; 11 -5,9; 12 -6.27,9; 13 -7.54,9; 14 -8.81,9; 25 -8.81,-9; 26 -7.54,-9; 27 -6.27,-9; 28 -5,-9; 29 -3.73,-9; 30 -2.46,-9; 31 -1.19,-9; 32 0.08,-9; 33 1.35,-9; 34 2.62,-9; 35 3.89,-9; 36 5.16,-9; 37 6.43,-9; 38 7.7,-9 | smd 1.5 x 0.9: 15 -10.3,5.715; 16 -10.3,4.445; 17 -10.3,3.175; 18 -10.3,1.905; 19 -10.3,0.635; 20 -10.3,-0.635; 21 -10.3,-1.905; 22 -10.3,-3.175; 23 -10.3,-4.445; 24 -10.3,-5.715 | smd 6 x 6: GND 0,0
SOT143 = smd 1.4 x 1.1: 1 -1.35,0.86 | smd 1.4 x 0.9: 2 -1.35,-0.96; 3 1.35,-0.96; 4 1.35,0.96
SOT223-3 = smd 1 x 1.5: 1 -2.3,-3.15; 2 0,-3.15; 3 2.3,-3.15 | smd 3.3 x 1.5: TAB 0,3.15
NKK_SPDT_SS312SAH4-R = smd 2.55 x 1: P$1 4.825,-2; P$2 4.825,0; P$3 4.825,2 | smd 1.7 x 1.7: P$4 1.35,4.9; P$5 1.35,-4.9
HONEYWELL_HSC_SMT = smd 1.143 x 2.032: P$1 -3.81,-5.715; P$2 -1.27,-5.715; P$3 1.27,-5.715; P$4 3.81,-5.715; P$5 3.81,5.715; P$6 1.27,5.715; P$7 -1.27,5.715; P$8 -3.81,5.715 | drill 0.6 square: P$9 -3.81,-6.604; P$10 -1.27,-6.604; P$11 1.27,-6.604; P$12 3.81,-6.604; P$13 3.81,6.604; P$14 1.27,6.604; P$15 -1.27,6.604; P$16 -3.81,6.604

### Placement (x,y rotation side)
C1  22.38,19.53 90 top
C2  14.92,18.57 90 top
C3  26.67,18.67 90 top
C4  29.53,7.14 270 top
C5  11.27,18.73 90 top
C6  16.67,7.14 90 top
C7  36.67,34.29 90 top
C8  38.26,34.29 90 top
C9  48.99,24.61 180 top
C10  45.66,24.61 180 top
C11  52.29,27.62 180 top
C12  52.29,29.69 180 top
C13  44.45,32 90 top
C825  55.24,12.38 180 top
C826  71.75,12.38 180 top
C827  74.9,25.84 0 top
C925  55.24,13.97 180 top
C926  71.75,13.97 180 top
C927  74.9,24 0 top
D1  20.8,6.99 90 top
D2  24.29,6.99 90 top
D3  27.78,6.99 90 top
D4  27.3,26.67 90 top
FRAME1  11.05,-8.7 0 top  (outside the outline)
IC1  33.18,29.84 180 top
J2  83.82,27.3 90 top
J3  17.78,27.3 270 top
J4  24.13,31.75 270 top
J5  4.06,25.4 270 top
JP1  82.55,32.38 180 top
JP2  82.55,35.56 180 top
R1  13.18,18.89 270 top
R2  16.51,18.76 270 top
R3  32.38,33.34 180 top
R4  32.38,34.92 0 top
R5  18.41,18.73 90 top
R6  35.08,34.29 270 top
R7  24.61,18.73 90 top
R8  26.04,7.14 270 top
R9  19.05,7.14 270 top
R10  79.38,35.73 180 top
R11  22.54,7.14 270 top
R12  79.38,32.55 180 top
R13  40.96,31.91 0 top
R14  40.96,26.51 0 top
R15  16.67,10.48 270 top
R16  20.32,11.59 180 top
R17  14.92,15.08 180 top
R18  11.27,10.95 90 top
R19  27.3,30.51 90 top
R20  5.97,33.66 270 top
R21  4,33.66 270 top
R22  44.45,28.19 270 top
T1  41.27,29.21 270 top
T2  41.43,34.45 270 top
U1  19.68,15.08 270 top
U2  13.81,9.05 0 top
U3  55.88,28.57 0 top
U4  43.02,13.02 0 top
U7  4.92,17.78 270 top
U$1  26.19,12.86 270 top
U$3  0,10.67 0 top
U$925  60.96,6.35 270 top
U$926  77.47,6.35 270 top
U$927  69.22,31.75 90 top

### Tracks (layer width: path | path; a pad name or v marks a point on that pad's centre or on a via)
!CHG!  (via drill 0.35)
  Top 0.178: R9.2 19.21,6.13 v19.21,5.24 | U1.9 21.7,14.33 v22.07,13.97
  Bottom 0.178: v22.07,13.97 v22.06,13.97 20.46,13.97 19.21,12.71 v19.21,5.24
AUX_RX  (via drill 0.35)
  Top 0.178: U4.29 39.29,5.64 v39.37,5.71
  Bottom 0.178: v39.37,5.71 39.37,16.45 35.72,20.1 29.58,20.1 25.9,23.79 25.9,25.13 24.36,26.67 J4.3
AUX_TX  (via drill 0.35)
  Top 0.178: U4.28 38.02,5.64 v38.1,5.71
  Bottom 0.178: v38.1,5.71 36.88,6.93 36.88,15.72 32.99,19.61 29.16,19.61 24.63,24.14 24.14,24.14 J4.4
BATTERY_IN  (via drill 0.35)
  Top 0.178: v15.4,6.51 15.08,6.51 14.81,6.78 U2.6 | C5.1 11.78,17.88 13.49,16.17 13.49,15.11 R17.2 13.52,14.16 14.45,13.23 v14.45,12.22 14.45,11.6 14.42,11.57 U2.8 | v9.84,15.24 9.84,15.21 | v10.79,15.24 10.79,15.21
  Top 1.27: R17.2 13.4,15.21 10.79,15.21 9.84,15.21
  Bottom 0.178: v15.4,6.51 14.45,7.46 v14.45,12.22
  Bottom 1.27: v9.84,15.24 v11.75,15.24 12.51,16 12.51,23.94 v13.34,24.77 v15.24,24.77
  other vias: 14.29,24.77
  pour Top (no thermals): 12.7,26.04 15.88,26.04 15.88,24.13 12.7,24.13
EN  (via drill 0.35)
  Top 0.178: 42.38,29.06 T1.3 | v45.72,20.64 47.62,20.64 48.18,21.19 U4.3 | C13.1 R22.1 44.28,29.21 T1.3 | T1.3 42.7,28.88 v42.7,27.94
  Bottom 0.178: v42.7,27.94 42.7,23.65 v45.72,20.64
GND  (via drill 0.35)
  Top 0.178: 19.4,15.08 U1.EP | U1.5 18.93,14.33 U1.EP | U1.8 20.43,14.33 U1.EP | U2.EP2 12.91,7.95 13.48,8.51 13.59,8.51 | 13.59,8.51 v13.72,8.51 | U2.EP3 14.15,7.95 13.59,8.51 | U2.EP4 14.21,10.15 v13.72,9.65 13.22,10.15 U2.EP1 | U2.3 13.61,8.85 U2.EP | 34.29,30.96 v34.29,30.99 | IC1.M 35.25,27.74 | IC1.3 33.68,29.34 IC1.EXP 34.88,28.14
  Top 0.254: J5.A1 6.63,28.4 J5.B12 | J5.A12 7.73,22.3 J5.B1
  other vias: 33.15,29.84 19.3,14.73 20.07,14.73 20.07,15.49 19.3,15.49 36.45,5.71 40.64,6.6 49.28,20.32 34.16,28.83 32.13,30.99 32.13,28.83 59.69,34.92 61.59,24.45 85.72,3.17 85.72,15.88 85.72,12.7 85.72,9.53 85.72,6.35 50.8,12.7 50.8,9.53 50.8,6.35 41.27,9.14 41.27,11.43 41.27,14.73 38.1,15.88 34.92,9.53 34.92,12.7 34.92,19.05 22.23,25.4 19.05,25.4 19.05,28.57 22.23,28.57 22.23,31.75 9.53,31.75 6.35,6.35 9.53,6.35 12.7,3.17 6.35,3.17 3.17,3.17 3.17,6.35 6.35,36.32 3.17,36.32 12.7,34.92 19.05,34.92 22.23,34.92 25.4,34.92 28.57,34.92 28.57,31.75 28.57,28.57 38.1,31.75 31.75,25.4 34.92,15.88 43.94,11.43 43.94,9.14 43.94,14.73 38.1,19.05 28.57,19.05 28.57,15.88 28.57,22.23 28.57,25.4 15.88,2.79 19.05,2.79 22.23,2.79 25.4,2.79 28.57,2.79 34.92,6.35 38.1,12.7 38.1,9.53 25.4,12.7 25.4,22.23 22.23,22.23 85.72,19.05 35.99,27.41 62.23,14.61 78.11,14.61 62.23,8.89 78.11,8.89 62.23,2.54 78.11,2.54 55.09,25.04 85.72,34.92
  pour Top (rank 2): 0,38.1 88.9,38.1 88.9,0 0,0
  pour Bottom (rank 2): 0,0 0,38.1 88.9,38.1 88.9,0
GND1  (via drill 0.35)
  other vias: 55.24,34.92
GND2  (via drill 0.35)
  other vias: 50.16,34.92
GPOUT  (via drill 0.35)
  Top 0.178: v16.35,13.18 16.67,12.86 R15.1 | v13.49,13.18 12.81,12.49 U2.12
  Bottom 0.178: v13.49,13.18 v16.35,13.18
ILIM
  Top 0.178: U1.12 21.48,15.83 22.11,16.47 22.99,16.47 23.14,16.61 24.4,17.88 R7.1
IO0  (via drill 0.35)
  Top 0.178: T2.3 42.86,34.12 v42.86,33.34 | U4.25 34.29,4.09 34.29,4.75 36.95,7.42 46.47,7.42 v46.67,7.62
  Bottom 0.178: v42.86,33.34 46.67,29.53 v46.67,7.62
ISET
  Top 0.178: R5.1 18.41,17.09 U1.16
MISO  (via drill 0.35)
  Top 0.178: U4.31 41.83,5 43.02,6.19 47.94,6.19 48.26,6.51 48.26,15.3 49.47,16.51 v49.53,16.51 | v58.42,16.51 v58.43,16.5 58.43,7.63 55.88,5.08 U$925.P$3 | v71.25,16.51 71.23,16.53 71.23,30.16 74.09,33.02 U$927.P$3 | v74.93,16.51 74.93,7.62 72.39,5.08 U$926.P$3
  Bottom 0.178: v49.53,16.51 v58.42,16.51 v71.25,16.51 v74.93,16.51
N$1  (via drill 0.35)
  Top 0.178: v27.53,24.66 27.53,25.45 27.3,25.68 D4.A | U4.9 40.56,21.03 v40.96,20.64
  Bottom 0.178: v40.96,20.64 31.53,20.64 27.53,24.64 v27.53,24.66
N$2
  Top 0.178: R19.1 D4.C
N$3
  Top 0.178: R10.1 81.86,35.73 JP2.2
N$4
  Top 0.178: R3.1 33.34,33.44 34.18,32.6 IC1.9
N$5
  Top 0.178: R4.2 33.6,34.92 R6.2 35.08,32.55 IC1.8
N$6
  Top 0.178: U1.6 19.47,13.57 R16.2
N$7
  Top 0.178: T1.1 41.81,31.79 R13.2
N$8  (via drill 0.35)
  Top 0.178: R14.2 41.91,26.61 v41.91,27.62 | T2.1 v41.27,34.45
  Bottom 0.178: v41.27,34.45 41.59,34.13 41.59,27.94 v41.91,27.62
N$9
  Top 0.178: R12.1 81.86,32.55 JP1.2
N$11
  Top 0.178: R9.1 20.66,7.99 D1.C
N$14
  Top 0.178: C6.1 16.12,5.75 15.16,5.75 14.42,6.49 U2.5
N$19  (via drill 0.35)
  Top 0.178: R11.2 v22.54,5.24 | v20.32,12.57 19.93,12.96 U1.7
  Bottom 0.178: v20.32,12.57 21.43,11.46 21.43,6.35 v22.54,5.24
N$20
  Top 0.178: R11.1 24.16,7.99 D2.C
N$22
  Top 0.178: R8.1 27.65,7.99 D3.C
N$23  (via drill 0.35)
  Top 0.178: U2.10 13.61,12.11 v13.49,12.22 | v12.22,13.18 11.27,12.22 R18.2
  Bottom 0.178: v13.49,12.22 13.3,12.22 12.35,13.18 v12.22,13.18
SCL  (via drill 0.35)
  Top 0.178: v48.1,5.56 48.18,5.48 U4.36 | U2.2 13.21,6.19 15.3,4.1 31.78,4.1 33.18,2.7 v48.1,2.7 51.31,2.7 51.94,3.33 v51.94,20.7 54.24,23 54.24,27.73 54.84,28.32 U3.2 | v85.72,28.57 85.6,28.7 83.92,28.7 J2.4 84.33,29.32 84.33,34.41 83.18,35.56 JP2.1
  Bottom 0.178: v48.1,2.7 v48.1,5.56 | v51.94,20.7 77.85,20.7 v85.72,28.57
SCLK  (via drill 0.35)
  Top 0.178: U4.30 40.48,4.1 40.48,4.92 42.27,6.71 47.35,6.71 47.62,6.99 47.62,15.75 49.05,17.18 50.26,17.18 v50.29,17.14 | v70.1,17.14 70.06,17.19 70.06,31.64 73.98,35.56 U$927.P$4 | v59.56,17.14 59.6,17.18 59.6,6.26 55.88,2.54 U$925.P$4 | v76.2,17.14 76.24,17.11 76.24,6.39 72.39,2.54 U$926.P$4
  Bottom 0.178: v50.29,17.14 v59.56,17.14 v70.1,17.14 v76.2,17.14
SDA  (via drill 0.35)
  Top 0.178: v44.29,5.56 44.37,5.48 U4.33 | U2.1 12.81,5.89 15.02,3.68 31.32,3.68 33.1,1.91 v44.29,1.91 51.75,1.91 52.7,2.86 v52.7,19.81 52.72,19.81 55.9,23 55.9,27.79 U3.4 | 83.84,27.78 84.62,27.78 v85.72,26.67 | 83.84,27.78 J2.3 | JP1.1 83.07,31.38 82.55,30.86 82.55,28.19 82.96,27.78 83.84,27.78
  Bottom 0.178: v44.29,1.91 v44.29,5.56 | v52.7,19.81 52.83,19.68 78.74,19.68 v85.72,26.67
SS_25  (via drill 0.35)
  Top 0.178: U4.10 39.29,20.4 40.64,19.05 v49.66,19.05 | v64.64,19.05 v64.65,19.05 64.65,3.93 65.53,3.05 66.04,2.54 U$925.P$5
  Bottom 0.178: v49.66,19.05 v64.64,19.05
SS_26  (via drill 0.35)
  Top 0.178: v50.29,18.41 40.58,18.41 38.02,20.97 U4.11 | v80.39,18.41 80.33,18.41 80.33,4.75 82.04,3.05 82.55,2.54 U$926.P$5
  Bottom 0.178: v50.29,18.41 v80.39,18.41
SS_27  (via drill 0.35)
  Top 0.178: U4.12 36.8,21.97 36.8,21.5 40.52,17.78 v49.53,17.78 | v66.8,17.78 66.67,17.91 66.67,33.34 64.45,35.56 U$927.P$5
  Bottom 0.178: v49.53,17.78 v66.8,17.78
SYSOFF  (via drill 0.35)
  Top 0.178: U1.15 19.43,17.68 v19.53,17.78 | U$3.P$2 v6.86,10.67 | U1.4 18.14,14.26 17.84,14.26 17.63,14.04 17.63,13.95 v17.4,13.72
  Bottom 0.178: v6.86,10.67 10.27,14.08 15.93,14.08 | v19.53,17.78 19.53,17.68 15.93,14.08 | 15.93,14.08 17.03,14.08 v17.4,13.72
SYSOFF_OFF
  Top 0.178: R1.1 12.16,18.73 10.36,18.73 7.68,16.05 7.68,9.71 6.64,8.67 U$3.P$1
TS
  Top 0.178: U1.1 18.17,15.87 17.72,15.87 16.51,17.08 R2.2
USB_CC1  (via drill 0.35)
  Top 0.178: v5.97,31.5 R20.2 | J5.A5 7.85,26.42 v9.02,26.42
  Bottom 0.178: v9.02,26.42 8.94,26.42 5.97,29.39 v5.97,31.5
USB_CC2  (via drill 0.35)
  Top 0.178: v5.46,24.13 5.98,24.65 J5.B5 | v4.06,31.5 4.06,32.74 R21.2
  Bottom 0.178: v5.46,24.13 4.06,25.53 v4.06,31.5
USB_D+  (via drill 0.35)
  Top 0.178: IC1.4 36.04,29.84 36.23,29.65 v36.35,29.65 | U7.3 4.83,17.3 4.83,24.51 5.46,25.15 J5.B6 7.08,25.15 J5.A6 8.64,25.9 v9.02,25.53
  Bottom 0.178: v36.35,29.65 36.73,29.65 37.07,29.99 37.07,31.35 34.58,33.85 17.34,33.85 v9.02,25.53
USB_D-  (via drill 0.35)
  Top 0.178: IC1.5 36.22,30.34 v36.35,30.48 | U7.2 4.06,19.23 4.06,24.64 v5.08,25.65 J5.B7 | v9.02,24.64 8.98,24.64 8.72,24.9 J5.A7
  Bottom 0.178: v36.35,30.48 36.35,31.37 34.38,33.34 17.78,33.34 9.08,24.64 v9.02,24.64 6.1,24.64 v5.08,25.65
USB_DTR  (via drill 0.35)
  Top 0.178: T2.2 40.11,33.27 R13.1 37.94,29.74 v37.94,28.86 | v36.35,28.73 36.61,28.48 36.61,27.1 36.2,26.69 34.91,26.69 34.68,26.93 IC1.28
  Bottom 0.178: v37.94,28.86 36.48,28.86 v36.35,28.73
USB_RTS  (via drill 0.35)
  Top 0.178: T1.2 40.11,28.19 R14.1 39.37,26.51 v37.94,27.94 | IC1.24 32.68,27.12 v32.23,26.67
  Bottom 0.178: v32.23,26.67 32.29,26.74 36.74,26.74 v37.94,27.94
USB_RXD  (via drill 0.35)
  Top 0.178: IC1.25 33.19,26.89 34.68,25.4 v36.35,25.4 | v46.99,5.56 46.99,4.1 U4.35
  Bottom 0.178: v46.99,5.56 45.66,6.89 45.66,19.27 39.53,25.4 v36.35,25.4
USB_TXD  (via drill 0.35)
  Top 0.178: IC1.26 33.69,27.08 34.73,26.04 v35.56,26.04 | v45.56,5.56 45.56,4.1 U4.34
  Bottom 0.178: v45.56,5.56 45.56,5.68 45.12,6.13 45.12,18.38 38.83,24.67 36.1,24.67 35.56,25.21 v35.56,26.04
V_BATT
  Top 0.178: U2.7 15.29,11.5 15.29,13.02 16.32,14.05 16.32,15.11 | 16.45,15.05 14.92,16.58 C2.1 13.54,17.67 R1.2
  pour Top (no thermals): 18.54,15.56 18.54,14.61 16.03,14.61 16.03,15.56
V_SUPPLY_UNREG  (via drill 0.35)
  Top 0.178: C3.1 24.06,15.16 24.05,15.16 | 24.05,15.16 U$1.1 23.02,15.16 | R16.1 23.97,11.59 v24.61,12.22 24.61,14.61 24.05,15.16 | v25.24,5.24 25.16,5.24 D2.A 24.16,6.11 24.1,6.16 24.1,5.59 23.11,4.6 22.12,4.6 20.8,5.93 D1.A
  Top 0.305: 22.71,15.49 U$1.1
  Bottom 0.178: v24.61,12.22 25.24,11.59 v25.24,5.24
  Bottom 0.635: J4.2 24.26,29.21 21.16,26.11 21.16,18.97 v25.02,15.11 v26.54,15.11
  other vias: 25.78,15.11
  pour Top (no thermals): 26.99,15.56 20.95,15.56 20.95,14.61 26.99,14.61
V_USB
  Top 0.178: R4.1 R3.2 31.03,33.34 30.46,33.91 14.73,33.91 9.91,29.08 9.91,27.08 | C1.1 20.67,18.13 20.64,18.16 | 9.88,24 9.88,20.43 U7.4 | 6.55,26.67 J5.B9
  Top 0.254: J5.B4 6.55,24.13 7.02,24.13 7.25,23.9 J5.A9 9.78,23.9 9.88,24 | 9.88,27.05 8.75,27.05 8.6,26.9 J5.A4 7.82,26.88 7.35,26.88 7.13,26.67 6.55,26.67
  Top 0.305: 20.64,17.02 20.64,16.76 U1.13
  Top 0.635: 20.64,17.02 20.64,18.16 20.64,20.32 18.86,22.1 11.78,22.1 9.88,24 9.88,27.05 9.91,27.08
VCC  (via drill 0.35)
  Top 0.178: U$1.3 22.11,9.63 R15.2 | 28.57,9.84 28.57,8.26 | 28.57,8.26 28.57,6.9 D3.A | C8.1 38.21,33.39 36.62,33.39 C7.1 35.69,32.46 35.69,31.34 | 28.57,8.26 28.79,8.04 C4.1 | IC1.6 35.48,30.9 | C827.1 72.52,25.84 | C927.1 72.58,24 72.52,24.07 | 73.91,13.97 C926.1 | 73.91,12.45 73.85,12.38 C826.1 | C925.1 57.05,13.97 | C825.1 56.99,12.38 57.05,12.45 | 46.61,23.45 46.51,23.56 C10.1 46.51,25.29 R22.2 | C9.1 49.89,24.61 50.28,24.61 | C12.1 54.25,29.69 U3.1 | U3.6 56.57,28.4 56.4,28.4 55.98,28.82 U3.1 | U3.1 55.38,29.09 U3.10 | v82.17,26.8 80.52,26.8 78.53,28.79 R12.2 R10.2
  Top 0.406: v57.02,21.84 57.05,21.81 57.05,13.97 57.05,12.45 57.05,8.79 55.88,7.62 U$925.P$2 | v73.91,21.84 73.91,13.97 73.91,12.45 73.91,9.43 72.1,7.62 U$926.P$2 | 35.48,30.9 IC1.7 35.69,31.34 36.75,31.34 37.15,30.95 37.15,23.49 37.11,23.45 | v72.52,21.84 72.52,24.07 72.52,25.84 72.52,29.02 73.98,30.48 U$927.P$2
  Top 0.635: U$1.3 26.11,10.56 26.83,9.84 28.57,9.84 30.16,9.84 31.35,11.03 31.35,22.07 32.73,23.45 37.11,23.45 46.61,23.45 48.68,23.45 | 48.68,23.45 49.4,23.45 49.89,23.94 49.89,24.61 | U4.2 49.46,22.68 48.68,23.45 | 48.68,23.45 48.72,23.5 v51.08,23.5 | C9.1 51.11,24.61 53.14,26.64 C11.1 C12.1 | v82.17,26.8 v82.18,26.8 J2.2
  Bottom 0.635: v51.08,23.5 51.08,22.71 51.94,21.84 v57.02,21.84 v72.52,21.84 v73.91,21.84 77.22,21.84 v82.17,26.8

### Text on the board
tPlace: ACT | CHG | USB | PWR | Ihab Awad